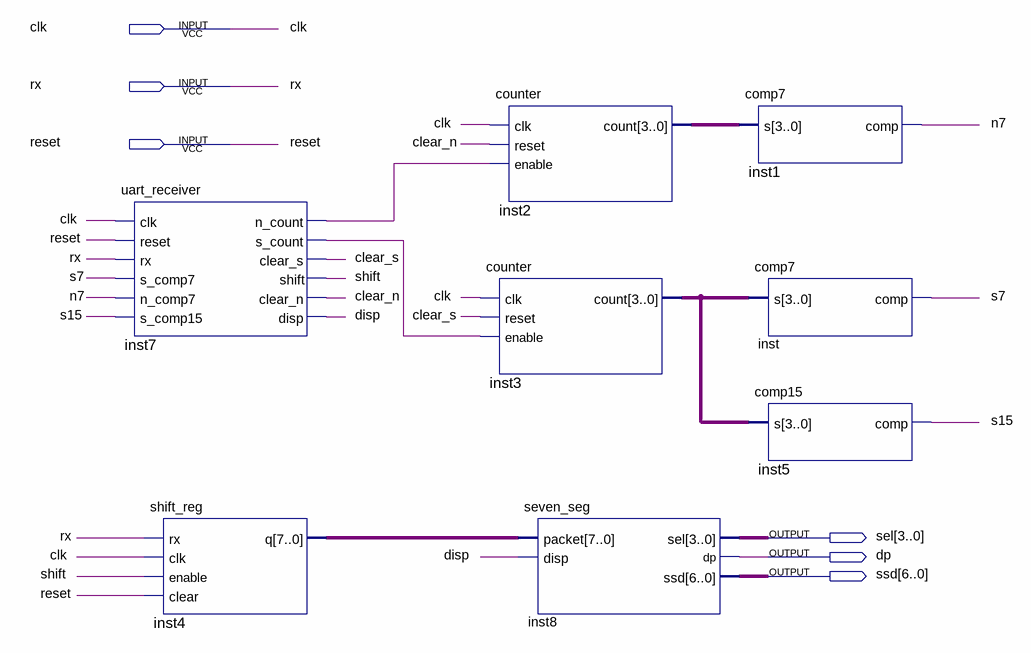
[diagram p0: schematic sheet]
// Quartus schematic schematic.bdf as structural Verilog: 8 symbols, 6 pins
module schematic (
  input  clk,
  input  rx,
  input  reset,
  output [3:0] sel,
  output dp,
  output [6:0] ssd
);

  wire clear_n, clear_s, disp, inst7_n_count, inst7_s_count, n7, s7, s15, shift;
  wire [3:0] inst2_count, inst3_count;
  wire [7:0] inst4_q;

  uart_receiver inst7 (
    .clk(clk), .reset(reset), .rx(rx), .s_comp7(s7), .n_comp7(n7), .s_comp15(s15), .n_count(inst7_n_count),
    .s_count(inst7_s_count), .clear_s(clear_s), .shift(shift), .clear_n(clear_n), .disp(disp));
  shift_reg inst4 (.rx(rx), .clk(clk), .enable(shift), .clear(reset), .q(inst4_q));
  counter inst2 (.clk(clk), .reset(clear_n), .enable(inst7_n_count), .count(inst2_count));
  counter inst3 (.clk(clk), .reset(clear_s), .enable(inst7_s_count), .count(inst3_count));
  seven_seg inst8 (.packet(inst4_q), .disp(disp), .sel(sel), .dp(dp), .ssd(ssd));
  comp7 inst1 (.s(inst2_count), .comp(n7));
  comp7 inst (.s(inst3_count), .comp(s7));
  comp15 inst5 (.s(inst3_count), .comp(s15));
endmodule
